# Altium schematic sheet Output channel.SchDoc
size A4; Organization: Altium Limited; Address1: L3, 12a Rodborough Rd; Address2: Frenchs Forest; Address3: NSW; Address4: Australia 2086; DocumentNumber: 7; SheetNumber: 7; SheetTotal: 8
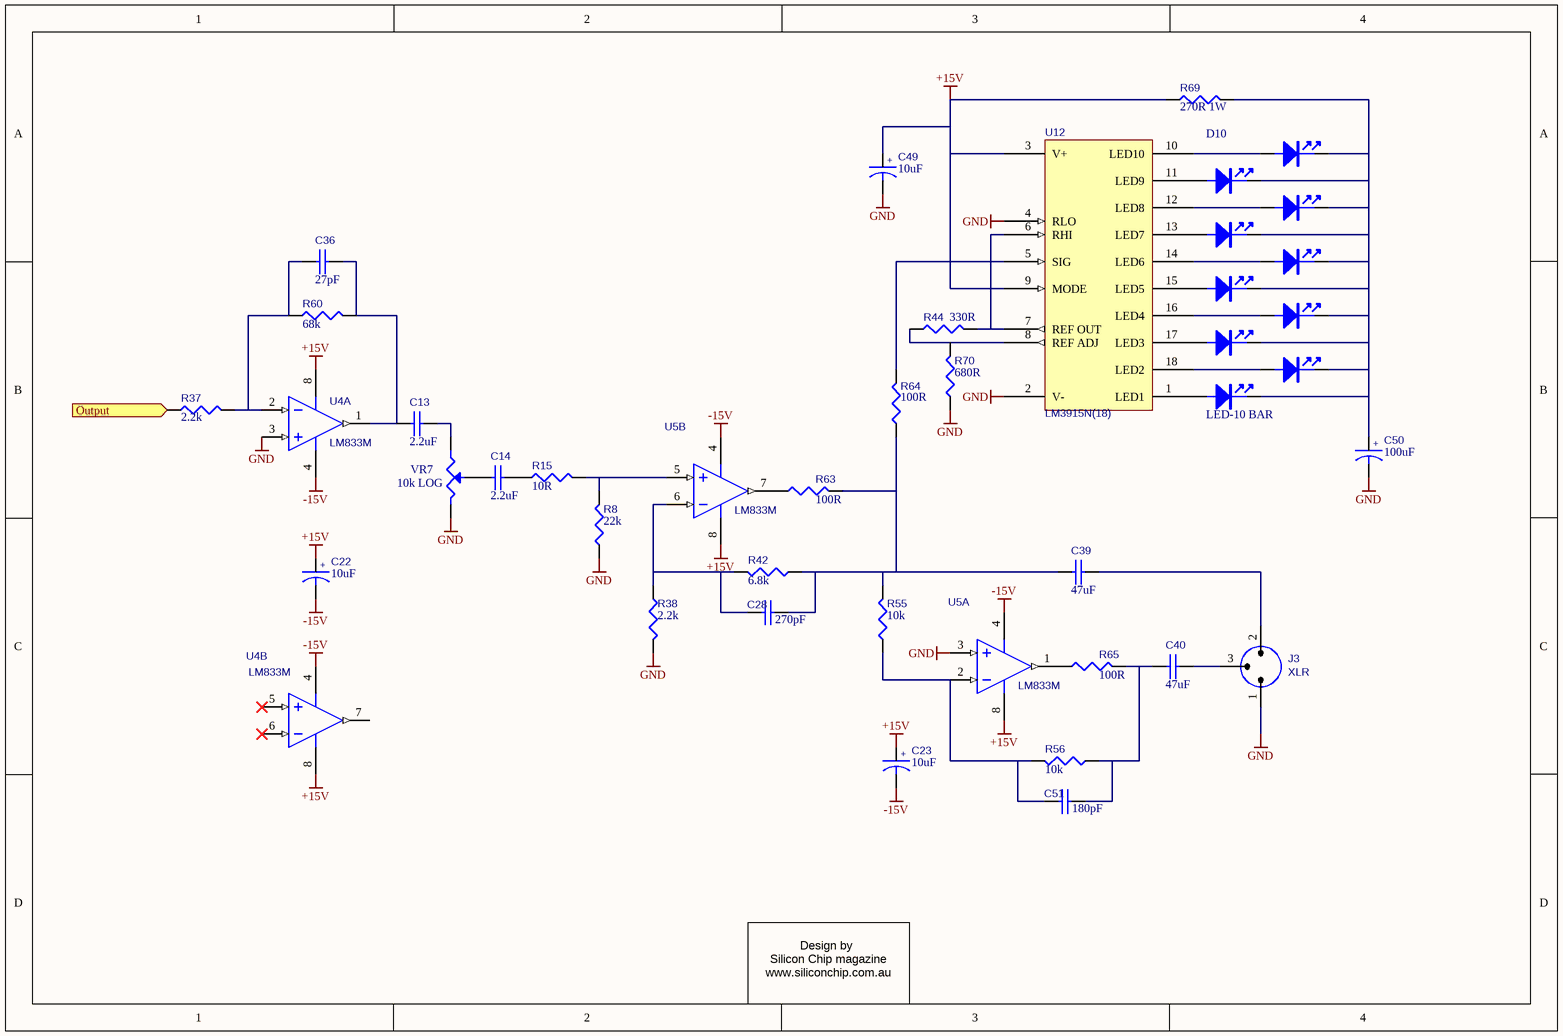
[diagram p0: Output channel.SchDoc]

## Parts
C13  2.2uF  [RB.2/.4-NP]
C14  2.2uF  [RB.2/.4-NP]
C22  10uF  [RB.2/.4]
C23  10uF  [RB.2/.4]
C28  270pF  [RAD0.2]
C36  27pF  [RAD0.2]
C39  47uF  [RB.2/.4-NP]
C40  47uF  [RB.2/.4-NP]
C49  10uF  [RB.2/.4]
C50  100uF  [RB.2/.4]
C51  180pF  [RAD0.2]
D10  LED-10 BAR  [LED - 10 BAR HORIZONTAL]
J3  XLR  [XLR-MALE]
R8  22k  [AXIAL0.4]
R15  10R  [AXIAL0.4]
R37  2.2k  [AXIAL0.4]
R38  2.2k  [AXIAL0.4]
R42  6.8k  [AXIAL0.4]
R44  330R  [AXIAL0.4]
R55  10k  [AXIAL0.4]
R56  10k  [AXIAL0.4]
R60  68k  [AXIAL0.4]
R63  100R  [AXIAL0.4]
R64  100R  [AXIAL0.4]
R65  100R  [AXIAL0.4]
R69  270R 1W  [AXIAL0.4]
R70  680R  [AXIAL0.4]
U4  LM833M  [DIP8]  (parts A,B of 2)
U5  LM833M  [DIP8]  (parts A,B of 2)
U12  LM3915N(18)  [DIP18]
VR7  10k LOG  [POT - 24MM]

## Ports
Output (in)

## Nets
+15V: C22.1 C23.1 C49.1 R69.1 U4.8(V+) U5.8(V+) U12.3(V+) U12.9(MODE)
-15V: C22.2 C23.2 U4.4(V-) U5.4(V-)
GND: C49.2 C50.2 J3.1 R8.1 R38.2 R70.1 U4.3(IN1+) U5.3(IN1+) U12.2(V-) U12.4(RLO) VR7.3
Output: R37.1 ; port Output
NetC13_1: C13.1 C36.2 R60.2 U4.1(OUT1)
NetC13_2: C13.2 VR7.1
NetC14_1: C14.1 VR7.2(W)
NetC14_2: C14.2 R15.1
NetC28_1: C28.1 R38.1 R42.2 U5.6(IN2-)
NetC28_2: C28.2 C39.1 R42.1 R55.2 R63.2 R64.1
NetC36_1: C36.1 R37.2 R60.1 U4.2(IN1-)
NetC39_2: C39.2 J3.2
NetC40_1: C40.1 C51.2 R56.1 R65.2
NetC40_2: C40.2 J3.3
NetC50_1: C50.1 D10.2(K) D10.4(K) D10.6(K) D10.8(K) D10.10(K) D10.12(K) D10.14(K) D10.16(K) D10.18(K) D10.20(K) R69.2
NetC51_1: C51.1 R55.1 R56.2 U5.2(IN1-)
NetD10_1: D10.1(A) U12.1(LED1)
NetD10_3: D10.3(A) U12.18(LED2)
NetD10_5: D10.5(A) U12.17(LED3)
NetD10_7: D10.7(A) U12.16(LED4)
NetD10_9: D10.9(A) U12.15(LED5)
NetD10_11: D10.11(A) U12.14(LED6)
NetD10_13: D10.13(A) U12.13(LED7)
NetD10_15: D10.15(A) U12.12(LED8)
NetD10_17: D10.17(A) U12.11(LED9)
NetD10_19: D10.19(A) U12.10(LED10)
NetR8_2: R8.2 R15.2 U5.5(IN2+)
NetR44_1: R44.1 R70.2 U12.8(REF_ADJ)
NetR44_2: R44.2 U12.6(RHI) U12.7(REF_OUT)
NetR63_1: R63.1 U5.7(OUT2)
NetR64_2: R64.2 U12.5(SIG)
NetR65_1: R65.1 U5.1(OUT1)

Not connected (* = marked no-connect by the designer): U4 5(IN2+)* 6(IN2-)* 7(OUT2)

## Notes on the sheet
- Design by
  Silicon Chip magazine
  www.siliconchip.com.au
- Title
- Size:
- Date:
- A4
- Number:
- Time:
- Revision:
- Sheet
- of
- File:
- (in symbol CAPACITOR POL) +

## Library data of the parts
C13 C14 C28 C36 C39 C40 C51 = CAP: Capacitor
  C36: Value: 27pF
C22 C23 C49 C50 = CAPACITOR POL: Bi-Polar Capacitor
  C23: Value: 10uF
J3 = XLR: XLR connector, PCB mounted
R8 R15 R37 R38 R42 R44 R55 R56 R60 R63-R65 R69 R70 = RES1: Resistor
  R8: Value: 22k
  R15: Value: 10R
  R37 R38: Value: 2.2k
  R42: Value: 6.8k
  R44: Value: 330R
  R55 R56: Value: 10k
  R60: Value: 68k
  R63-R65: Value: 100R
  R69: Value: 270R 1W
  R70: Value: 680R
U4 U5 = LM833M: Fast Settling Dual Operational Amplifier
U12 = LM3915N(18): Dot/Bar Display Driver
VR7 = POT1: Potentiometer